# EAGLE design nanobeam_soil_sensor (EAGLE 9.6.2)

## Sheet 1 of 2
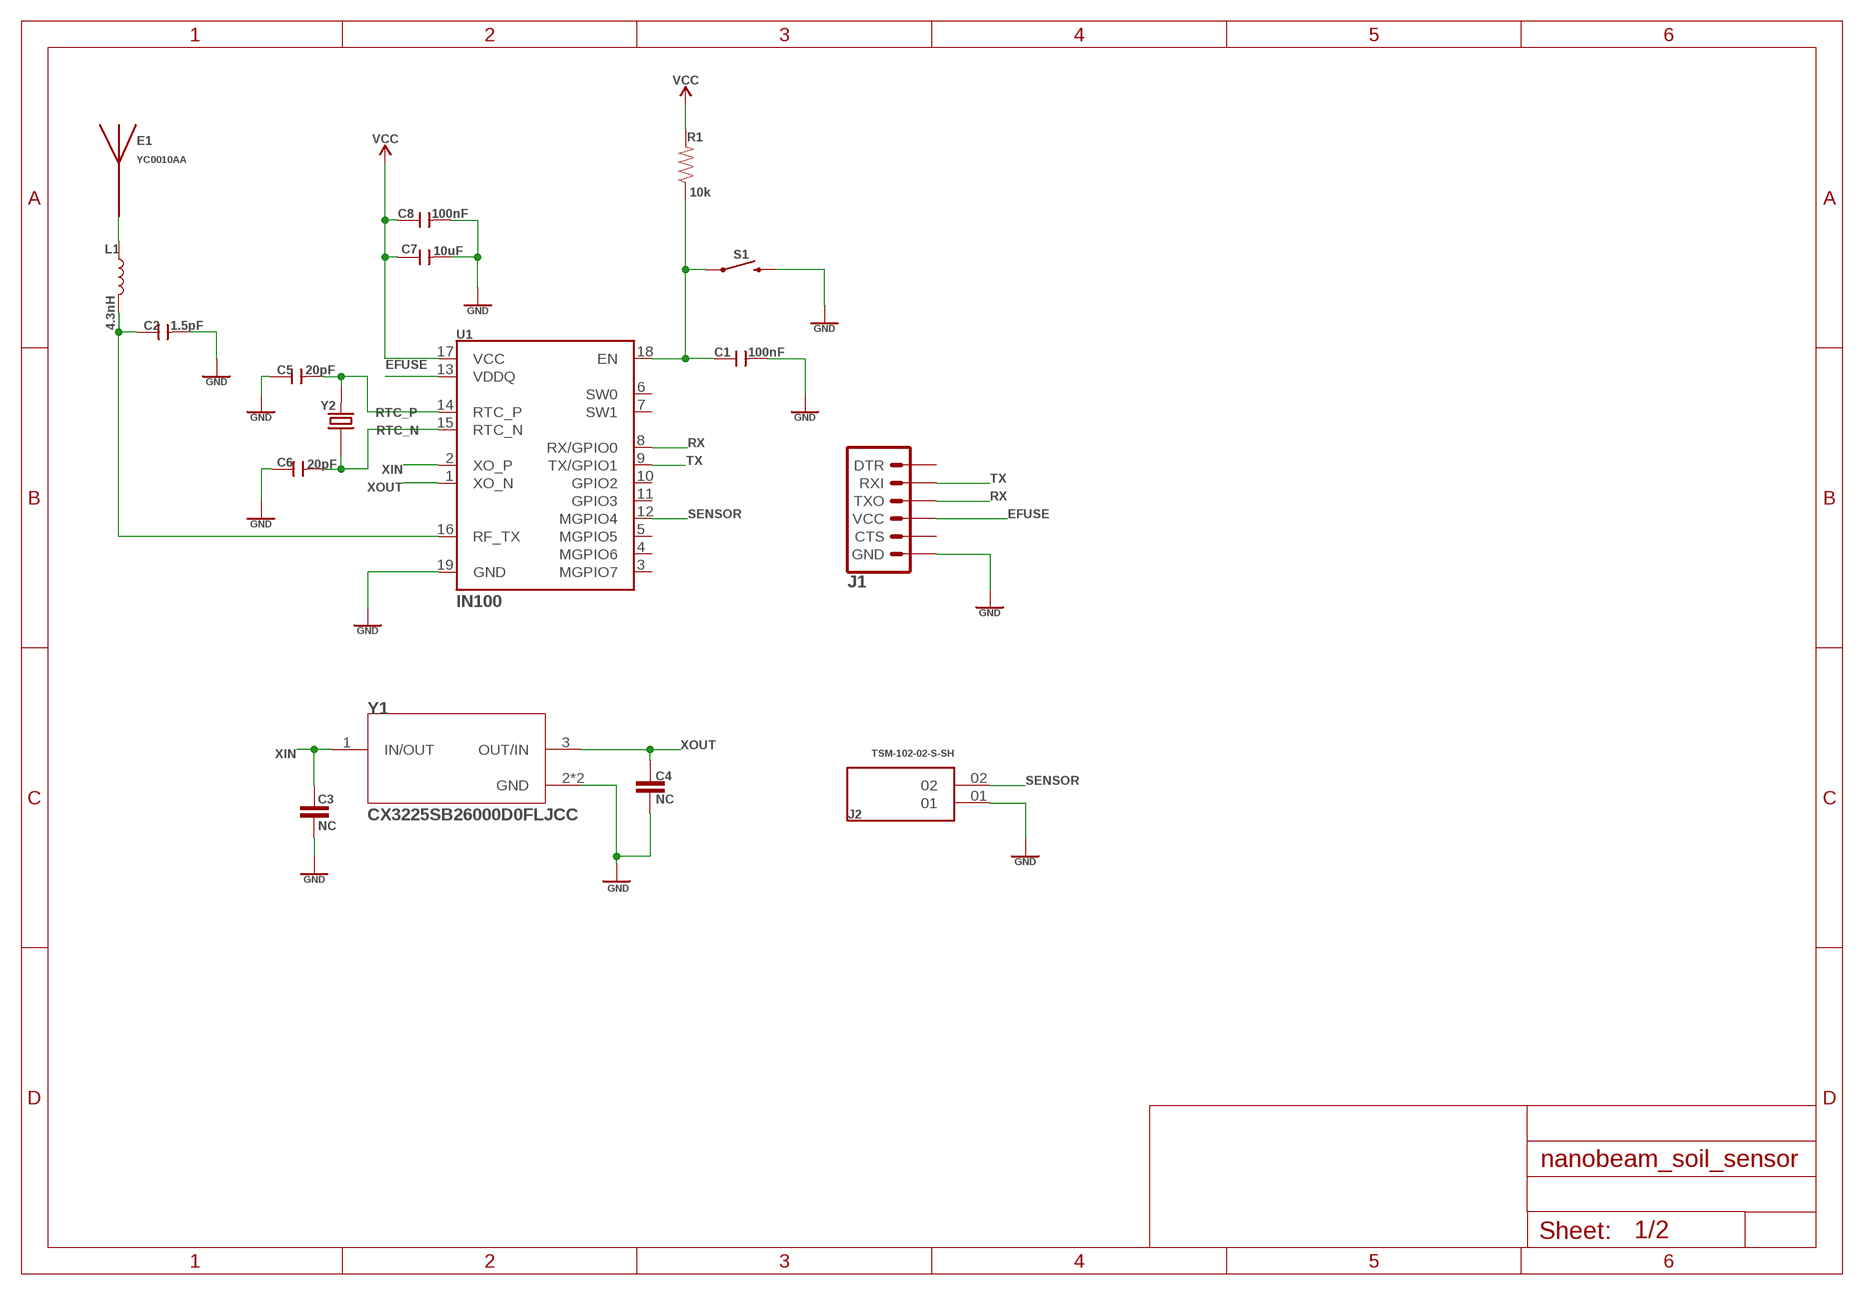
[diagram p0: schematic, sheet 1]

### Parts
C1  100nF  CERAMIC-100NF-50V-10%-X7R(0603)  [C0603]
C2  1.5pF  CERAMIC-10PF-50V-5%-NPO(0603)  [C0603]
C3  NC  12PF-0603-50V-5%  [0603]
C4  NC  12PF-0603-50V-5%  [0603]
C5  20pF  CERAMIC-22PF-50V-5%-NPO(0603)  [C0603]
C6  20pF  CERAMIC-22PF-50V-5%-NPO(0603)  [C0603]
C7  10uF  CERAMIC-10UF-10V-10%-X5R(0603)  [C0603]
C8  100nF  CERAMIC-100NF-50V-10%-X7R(0603)  [C0603]
E1  YC0010AA  [XCVR_YC0010AA]
J1  6_PIN_SERIAL_TARGETSMD  [1X06-SMD_RA_MALE]
J2  TSM-102-02-S-SH  [SAMTEC_TSM-102-02-S-SH]
L1  4.3nH  INDUCTOR-0603-33NH  [0603]
R1  10k  10KOHM-0603-1/10W-1%  [0603]
S1  MOMENTARY-SWITCH-SPST-SMD-4.6X2.8MM  [TACTILE_SWITCH_SMD_4.6X2.8MM]
U1  IN100  [IN100]
Y1  CX3225SB26000D0FLJCC  ECS-480-8-33B-CWY-TR3  [XTAL_ECS-480-8-33B-CWY-TR3]
Y2  ECS-.327-12.5-16-TR  [XTAL_ECS-.327-12.5-16-TR]

### Nets
EFUSE: J1.4(VCC) U1.13(VDDQ)
GND: C1.2 C2.2 C3.2 C4.2 C5.1 C6.1 C7.2 C8.2 J1.6(GND) J2.01 S1.3 S1.4 U1.19(GND) Y1.2(GND) Y1.4(GND) ; also sheet 2
N$1: C2.1 L1.2 U1.16(RF_TX)
N$2: E1.1 L1.1
N$3: C1.1 R1.1 S1.1 S1.2 U1.18(EN)
RTC_N: C6.2 U1.15(RTC_N) Y2.1
RTC_P: C5.2 U1.14(RTC_P) Y2.2
RX: J1.3(TXO) U1.8(RX/GPIO0)
SENSOR: J2.02 U1.12(MGPIO4)
TX: J1.2(RXI) U1.9(TX/GPIO1)
VCC: C7.1 C8.1 R1.2 U1.17(VCC) ; also sheet 2
XIN: C3.1 U1.2(XO_P) Y1.1(IN/OUT)
XOUT: C4.1 U1.1(XO_N) Y1.3(OUT/IN)
Unconnected: J1.1(DTR) J1.5(CTS) U1.3(MGPIO7) U1.4(MGPIO6) U1.5(MGPIO5) U1.6(SW0) U1.7(SW1) U1.10(GPIO2) U1.11(GPIO3)

## Sheet 2 of 2
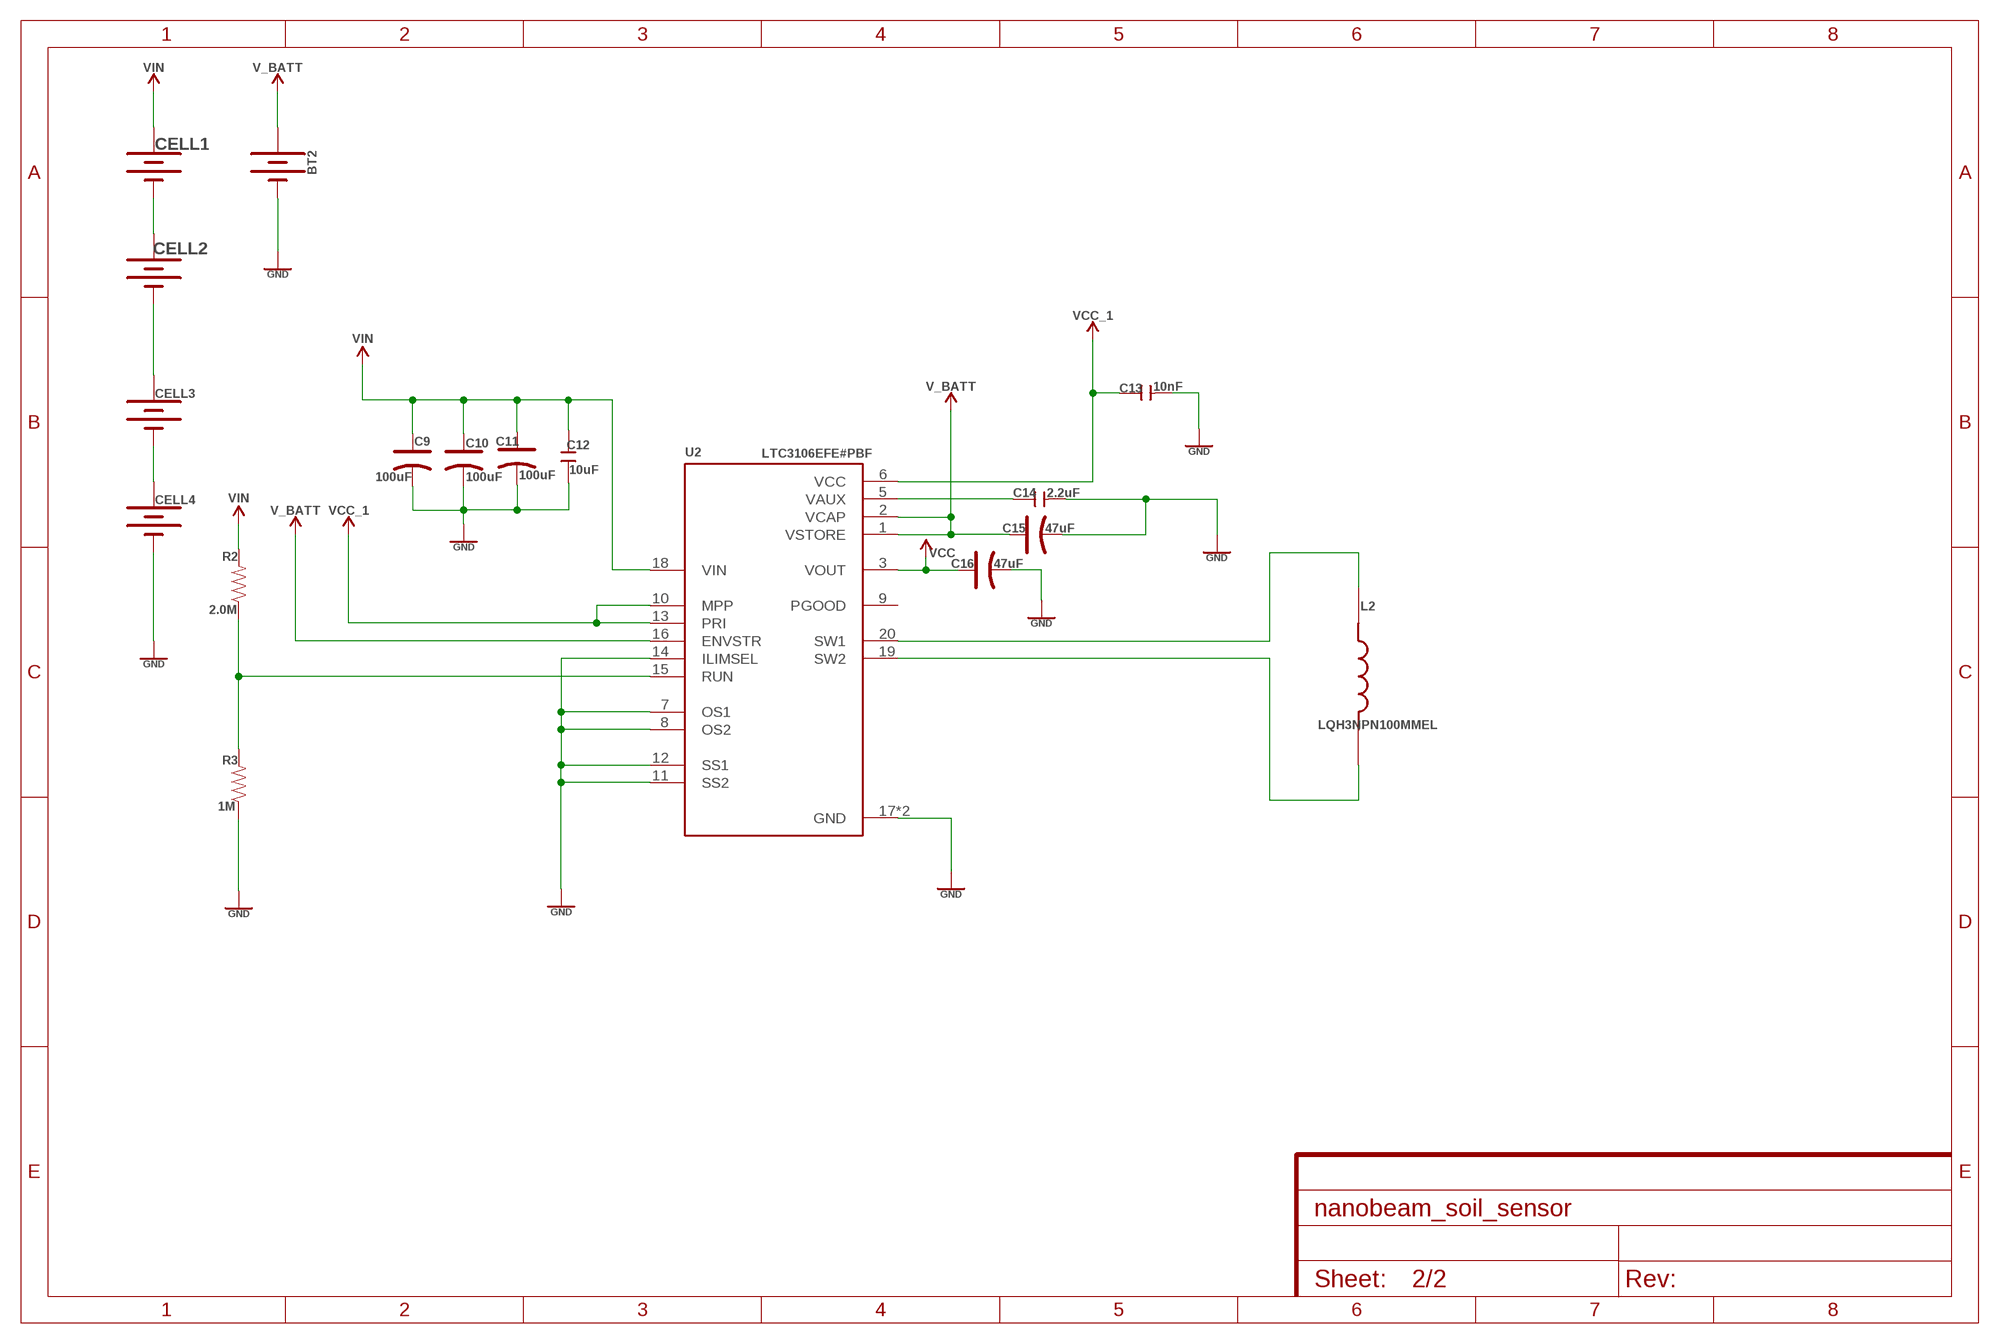
[diagram p1: schematic, sheet 2]

### Parts
BT2  BATTERY-12MM_SMD  [BATTCON_12MM]
C9  100uF  TANTALUM-SMD-47UF-6.3V(AVX-A)  [AVX-A]
C10  100uF  TANTALUM-SMD-47UF-6.3V(AVX-A)  [AVX-A]
C11  100uF  TANTALUM-SMD-47UF-6.3V(AVX-A)  [AVX-A]
C12  10uF  CERAMIC-10UF-6.3V-20%-X5R(0603)  [C0603]
C13  10nF  CERAMIC-10NF-50V-10%-X7R(0603)  [C0603]
C14  2.2uF  CERAMIC-2.2UF-10V-10%-X7R(0603)  [C0603]
C15  47uF  TANTALUM-SMD-47UF-6.3V(AVX-A)  [AVX-A]
C16  47uF  TANTALUM-SMD-47UF-6.3V(AVX-A)  [AVX-A]
CELL1  KXOB25  [KXOB25]
CELL2  KXOB25  [KXOB25]
CELL3  KXOB25  [KXOB25]
CELL4  KXOB25  [KXOB25]
L2  LQH3NPN100MMEL  [IND_LQH3NPN100MMEL]
R2  2.0M  2MOHMS-0603-1/10W-1%  [0603]
R3  1M  1MOHM-0603-1/4W-5%  [0603]
U2  LTC3106EFE#PBF  [SOP65P640X120-21N]

### Nets
GND: BT2.GND(-) C9.- C10.- C11.- C12.1 C13.2 C14.2 C15.- C16.- CELL4.- R3.1 U2.7(OS1) U2.8(OS2) U2.11(SS2) U2.12(SS1) U2.14(ILIMSEL) U2.17(GND) U2.21(GND) ; also sheet 1
N$4: L2.1 U2.20(SW1)
N$5: L2.2 U2.19(SW2)
N$6: CELL1.- CELL2.+
N$7: CELL2.- CELL3.+
N$8: CELL3.- CELL4.+
N$9: C14.1 U2.5(VAUX)
N$10: R2.1 R3.2 U2.15(RUN)
V_BATT: BT2.PWR@1(+) C15.+ U2.1(VSTORE) U2.2(VCAP) U2.16(ENVSTR)
VCC: C16.+ U2.3(VOUT) ; also sheet 1
VCC_1: C13.1 U2.6(VCC) U2.10(MPP) U2.13(PRI)
VIN: C9.+ C10.+ C11.+ C12.2 CELL1.+ R2.2 U2.18(VIN)
Unconnected: U2.9(PGOOD)

## Library data of the parts
BT2 = SparkFun-Batteries:BATTERY: Battery - Single Cell A variety of battery chemistries, sizes, and footprints. Device List: 20MM_PTH - Coin Cell Battery Holder - 20mm (PTH) <https://www.sparkfun.com/products/783> 6.8MM_PTH - Coin Cell Battery Holder - 6.8MM(SMD) <https://www.digikey.com/product-detail/en/seiko-instruments/MS621FE-FL11E/728-1057-ND/1889208?WT.srch=1&gclid=CNOQ5a6LzdQCFZS2wAodXCkE0g> 12MM_SMD - Coin Cell Battery Holder - 12mm (SMD) <https://www.sparkfun.com/products/10592> 12MM_PTH - Coin Cell Battery Holder - 12mm (PTH) <https://www.sparkfun.com/products/7948> 20MM_SMD - 20mm Coin Cell Battery Holder (SMD) (2 legs) Used on the Big Time Watch Kit <https://www.sparkfun.com/products/11734> 20MM_SMD_4LEGS - Coin Cell Battery Holder - 20mm (SMD) <https://www.sparkfun.com/products/11892> 20MM_SMD_4LEGS_OVERPASTE - Coin Cell Battery Holder - 20mm (SMD) <https://www.sparkfun.com/products/11892> (Over-paste on the legs) 24.5MM_PTH - Coin Cell Battery Holder - 24.5mm (PTH) <https://www.sparkfun.com/products/8863> 9V - 9V Battery Holder - PC Mount Used on the SparkFun SparkPunk Sound Kit <https://www.sparkfun.com/products/11177> and SparkFun SparkPunk Sequencer Kit <https://www.sparkfun.com/products/12707> 18650 - Battery Holder - 18650 (PTH) <https://www.sparkfun.com/products/13113> AA - Battery Holder - 1xAA (PTH) <https://www.sparkfun.com/products/7949> AAA - Battery Holder - 1xAAA (PTH) <https://www.sparkfun.com/products/12718> AA_KIT - Battery Holder - 1xAA (PTH) <https://www.sparkfun.com/products/7949> Special kit package - pads only have exposed copper on one side of the board. AAA_KIT - Battery Holder - 1xAAA (PTH) <https://www.sparkfun.com/products/12718> Special kit package - pads only have exposed copper on one side of the board.; PROD_ID: BATT-08044; SF_SKU: PRT-10592
C1 C8 = OPL_Capacitor:CERAMIC-100NF-50V-10%-X7R(0603): 302010138; MPN: CC0603KRX7R9BB104; VALUE: 100nf
C2 = OPL_Capacitor:CERAMIC-10PF-50V-5%-NPO(0603): 302010097; MPN: CC0603JRNPO9BN100; VALUE: 10pf
C3 C4 = SparkFun-Capacitors:12PF: 12pF ceramic capacitors A capacitor is a passive two-terminal electrical component used to store electrical energy temporarily in an electric field.; PROD_ID: CAP-09137; VALUE: 12pF
C5 C6 = OPL_Capacitor:CERAMIC-22PF-50V-5%-NPO(0603): 302010143; MPN: CC0603JRNPO9BN220; VALUE: 22pf
C7 = OPL_Capacitor:CERAMIC-10UF-10V-10%-X5R(0603): 302010103; MPN: CC0603KRX5R6BB106; VALUE: 10uf
C9-C11 C15 C16 = OPL_Capacitor:TANTALUM-SMD-47UF-6.3V(AVX-A): 302020005; MPN: TAJA476*006#NJ; VALUE: 47uf
C12 = OPL_Capacitor:CERAMIC-10UF-6.3V-20%-X5R(0603): 302010286; MPN: CC0603MRX5R5BB106; VALUE: 10UF 6.3V
C13 = OPL_Capacitor:CERAMIC-10NF-50V-10%-X7R(0603): 302010140; MPN: CC0603KRX7R9BB103; VALUE: 10nf
C14 = OPL_Capacitor:CERAMIC-2.2UF-10V-10%-X7R(0603): 302010054; MPN: CC0603KRX7R6BB225; VALUE: 2.2uf
CELL1-CELL4 = KXOB25:KXOB25
E1 = YC0010AA:YC0010AA: 2400 ~ 2500MHz, Wi-Fi（BT）, 5.2*2.0*1.2mm,ceramic SMD Antenna Check availability <https://pricing.snapeda.com/parts/YC0010AA/Quectel/view-part?ref=eda>; AVAILABILITY: In Stock; DESCRIPTION: 2400 ~ 2500MHz, Wi-Fi（BT）, 5.2*2.0*1.2mm,ceramic SMD Antenna; MF: Quectel; MP: YC0010AA; PACKAGE: None; PRICE: None; PURCHASE-URL: https://pricing.snapeda.com/search/part/YC0010AA/?ref=eda
J1 = SparkFun-Connectors:6_PIN_SERIAL_TARGET: 6-pin header connection for use with the "FTDI BASIC" pinout - TARGET SIDE. Also known as "Arduino Serial Program Header". It is used to mate with our FTDI Basic serial programmers using the Arduino IDE. Note, this device has "TARGET" in the name. It is intended to be used on a design that contains a target micro-controller that you wish to program. The "sister" device, named "CABLE" is inteneded to be used on a design that usually lives on the end of your USB cable and prvides the converter chip (FTDI232 or FTDI231x) to commnicate serial RX/TX. You can populate with some of these: Break Away Headers - Straight <https://www.sparkfun.com/products/116> (PRT-00116) For reference (or to suit your programming needs) check out these designs: SparkFun FTDI Basic Breakout - 5V <https://www.sparkfun.com/products/9716> (DEV-09716) SparkFun FTDI Basic Breakout - 3.3V <https://www.sparkfun.com/products/9873> (DEV-09873) SparkFun FTDI SmartBasic <https://www.sparkfun.com/products/12935> (DEV-12935) SparkFun Beefy 3 - FTDI Basic Breakout <https://www.sparkfun.com/products/13746> (DEV-13746); PROD_ID: CONN-08971
J2 = TSM-102-02-S-SH:TSM-102-02-S-SH: Check availability <https://pricing.snapeda.com/parts/TSM-102-02-S-SH/Samtec/view-part?ref=eda>; AVAILABILITY: In Stock; DESCRIPTION: TSM - Samtec 2.54mm Single Row Horizontal Surface Mount Header 8.13mm Post Height (02) - Fast Stock; MF: Samtec; MP: TSM-102-02-S-SH; PACKAGE: None; PRICE: None; PURCHASE-URL: https://pricing.snapeda.com/search/part/TSM-102-02-S-SH/?ref=eda
L1 = SparkFun-Coils:INDUCTOR: Inductors Resist changes in electrical current. Basically a coil of wire. SparkFun Products: SparkFun Load Cell Amplifier - HX711 <https://www.sparkfun.com/products/13879> IOIO-OTG - V2.2 <https://www.sparkfun.com/products/13613>; PROD_ID: NDUC-07874; VALUE: 33nH/±5%/500mA
L2 = LQH3NPN100MMEL:LQH3NPN100MMEL: Fixed Inductors; DESCRIPTION: 10µH Shielded Wirewound Inductor 800mA 228mOhm Max 1212 (3030 Metric); DIGI-KEY_PART_NUMBER: 490-15945-1-ND; DIGIKEY-PURCHASE-URL: https://snapeda.com/shop?store=DigiKey&id=4547508; MF: Murata; MOUSER-PURCHASE-URL: https://snapeda.com/shop?store=Mouser&id=4547508; MP: LQH3NPN100MMEL; PACKAGE: 1212 Murata
R1 = SparkFun-Resistors:10KOHM: 10kΩ resistor A resistor is a passive two-terminal electrical component that implements electrical resistance as a circuit element. Resistors act to reduce current flow, and, at the same time, act to lower voltage levels within circuits. - Wikipedia; PROD_ID: RES-00824
R2 = SparkFun-Resistors:2MOHMS: 2MΩ resistor A resistor is a passive two-terminal electrical component that implements electrical resistance as a circuit element. Resistors act to reduce current flow, and, at the same time, act to lower voltage levels within circuits. - Wikipedia; PROD_ID: RES-10054
R3 = SparkFun-Resistors:1MOHM: 1MΩ resistor A resistor is a passive two-terminal electrical component that implements electrical resistance as a circuit element. Resistors act to reduce current flow, and, at the same time, act to lower voltage levels within circuits. - Wikipedia; PROD_ID: RES-07868
S1 = SparkFun-Switches:MOMENTARY-SWITCH-SPST: Momentary Switch (Pushbutton) - SPST Normally-open (NO) SPST momentary switches (buttons, pushbuttons). Variants PTH-12MM - 12mm square, through-hole Momentary Pushbutton Switch - 12mm Square <https://www.sparkfun.com/products/9190> (COM-09190) PTH-6.0MM, PTH-6.0MM-KIT - 6.0mm square, through-hole Mini Pushbutton Switch <https://www.sparkfun.com/products/97> (COM-00097) KIT package intended for soldering kit's - only one side of pads' copper is exposed. PTH-RIGHT-ANGLE-KIT - Right-angle, through-hole Right Angle Tactile Button <https://www.sparkfun.com/products/10791> - Used on SparkFun BigTime Watch Kit <https://www.sparkfun.com/products/11734> SMD-12MM - 12mm square, surface-mount Tactile Button - SMD (12mm) <https://www.sparkfun.com/products/12993> (COM-12993) Used on SparkFun PicoBoard <https://www.sparkfun.com/products/11888> SMD-4.5MM - 4.5mm Square Trackball Switch Used on SparkFun Blackberry Trackballer Breakout <https://www.sparkfun.com/products/13169> SMD-4.6MMX2.8MM - 4.60mm x 2.80mm, surface mount Used on SparkFun SAMD21 Mini Breakout <https://www.sparkfun.com/products/13664> SMD-5.2MM, SMD-5.2-REDUNDANT - 5.2mm square, surface-mount Mini Pushbutton Switch - SMD <https://www.sparkfun.com/products/8720> (COM-08720) Used on Arduino Pro Mini <https://www.sparkfun.com/products/11114> REDUNDANT package connects both switch circuits together SMD-6.0X3.5MM - 6.0 x 3.5mm, surface mount Momentary Reset Switch SMD <https://www.sparkfun.com/products/8229> (COM-08229) SMD-6.2MM-TALL - 6.2mm square, surface mount Tactile Button - SMD (6mm) <https://www.sparkfun.com/products/12992> Used on SparkFun Digital Sandbox <https://www.sparkfun.com/products/12651> SMD-RIGHT-ANGLE - Right-angle, surface mount Used on SparkFun Block for Intel® Edison - Arduino <https://www.sparkfun.com/products/13036>; PROD_ID: SWCH-13065
U1 = IN100:IN100; PROD_ID: IC-17260
U2 = LTC3106EFE_PBF:LTC3106EFE#PBF: LTC3106 - 300mA Low Voltage Buck-Boost Converter with PowerPath and 1.6μA Quiescent Current; DESCRIPTION: Conv DC-DC -0.3V to 6V Non-Inv/Inv/Step Up/Step Down Single-Out 1.8V/2.2V/3.3V/5V 0.3A 20-Pin TSSOP; MF: Analog Devices; MOUSER-PURCHASE-URL: https://snapeda.com/shop?store=Mouser&id=4332360; MP: LTC3106EFE#PBF; PACKAGE: TSSOP W/ EP-20 Analog Devices
Y1 = CX3225SB26000D0FLJCC:ECS-480-8-33B-CWY-TR3: Check availability <https://pricing.snapeda.com/parts/ECS-480-8-33B-CWY-TR3/ECS%20Inc./view-part?ref=eda>; AVAILABILITY: In Stock; DESCRIPTION: Crystal - 48MHz ±10ppm - 10 pF - ±15 ppm - -30 to +85°C 3225 Low aging; MF: Kyocera; MP: CX3225SB26000D0FLJCC; PACKAGE: None; PRICE: None; PURCHASE-URL: https://pricing.snapeda.com/search/part/ECS-480-8-33B-CWY-TR3/?ref=eda
Y2 = ECS-.327-12.5-16-TR:ECS-.327-12.5-16-TR: SMD Tuning Fork Crystal Check availability <https://pricing.snapeda.com/parts/ECS-.327-12.5-16-TR/ECS%20Inc./view-part?ref=eda>; AVAILABILITY: In Stock; DESCRIPTION: 32.768 kHz ±20ppm Crystal 12.5pF 90 kOhms 2-SMD, No Lead; MF: ECS Inc.; MP: ECS-.327-12.5-16-TR; PACKAGE: SMD-2 ECS International; PRICE: None; PURCHASE-URL: https://pricing.snapeda.com/search/part/ECS-.327-12.5-16-TR/?ref=eda

## Board
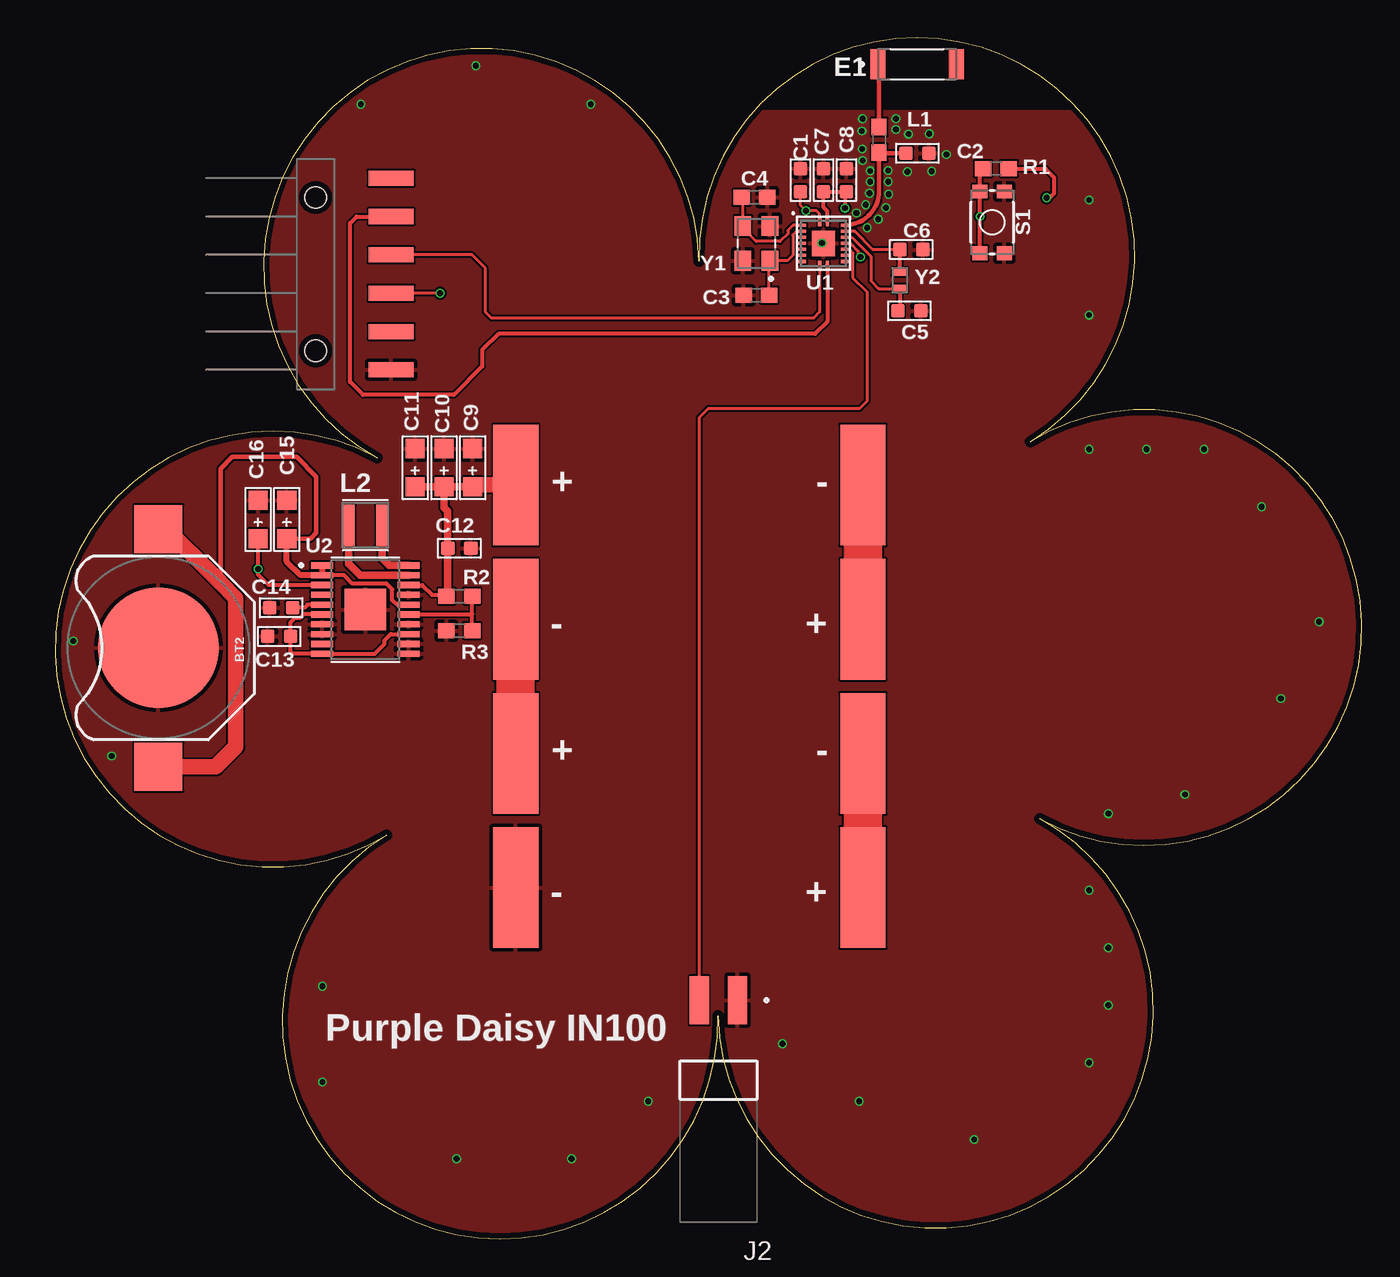
[diagram p2: board, top side]
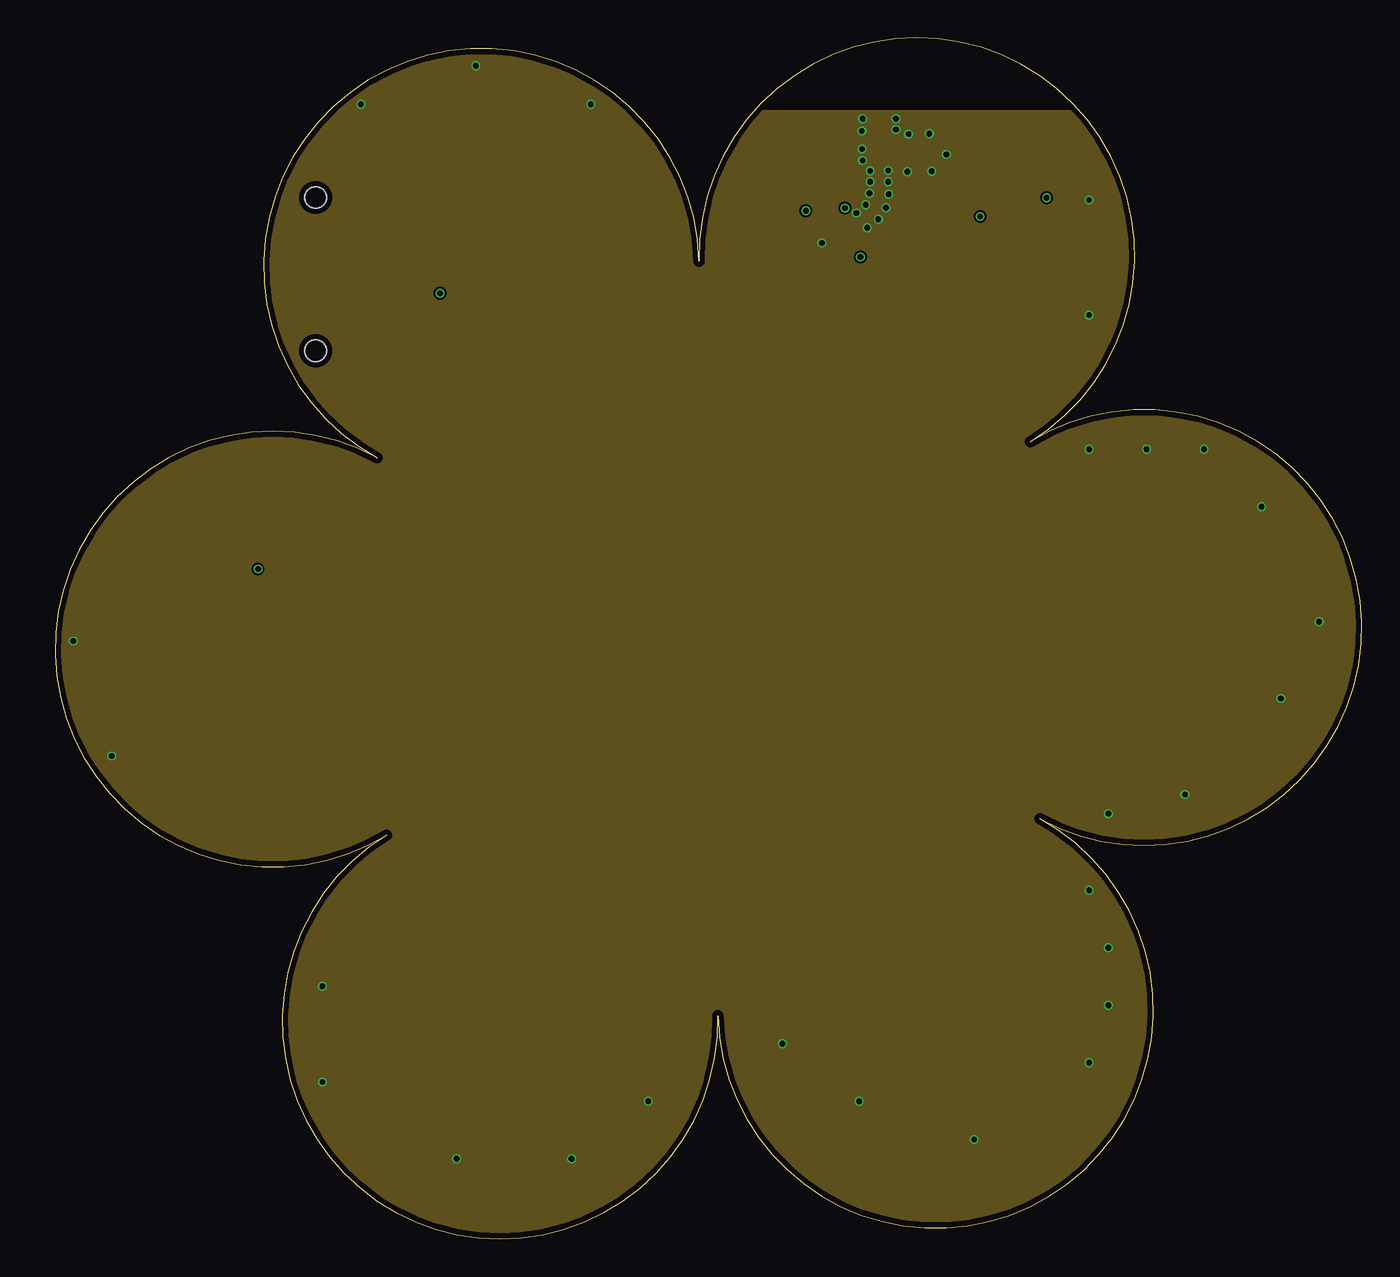
[diagram p3: board, inner layer Route2]
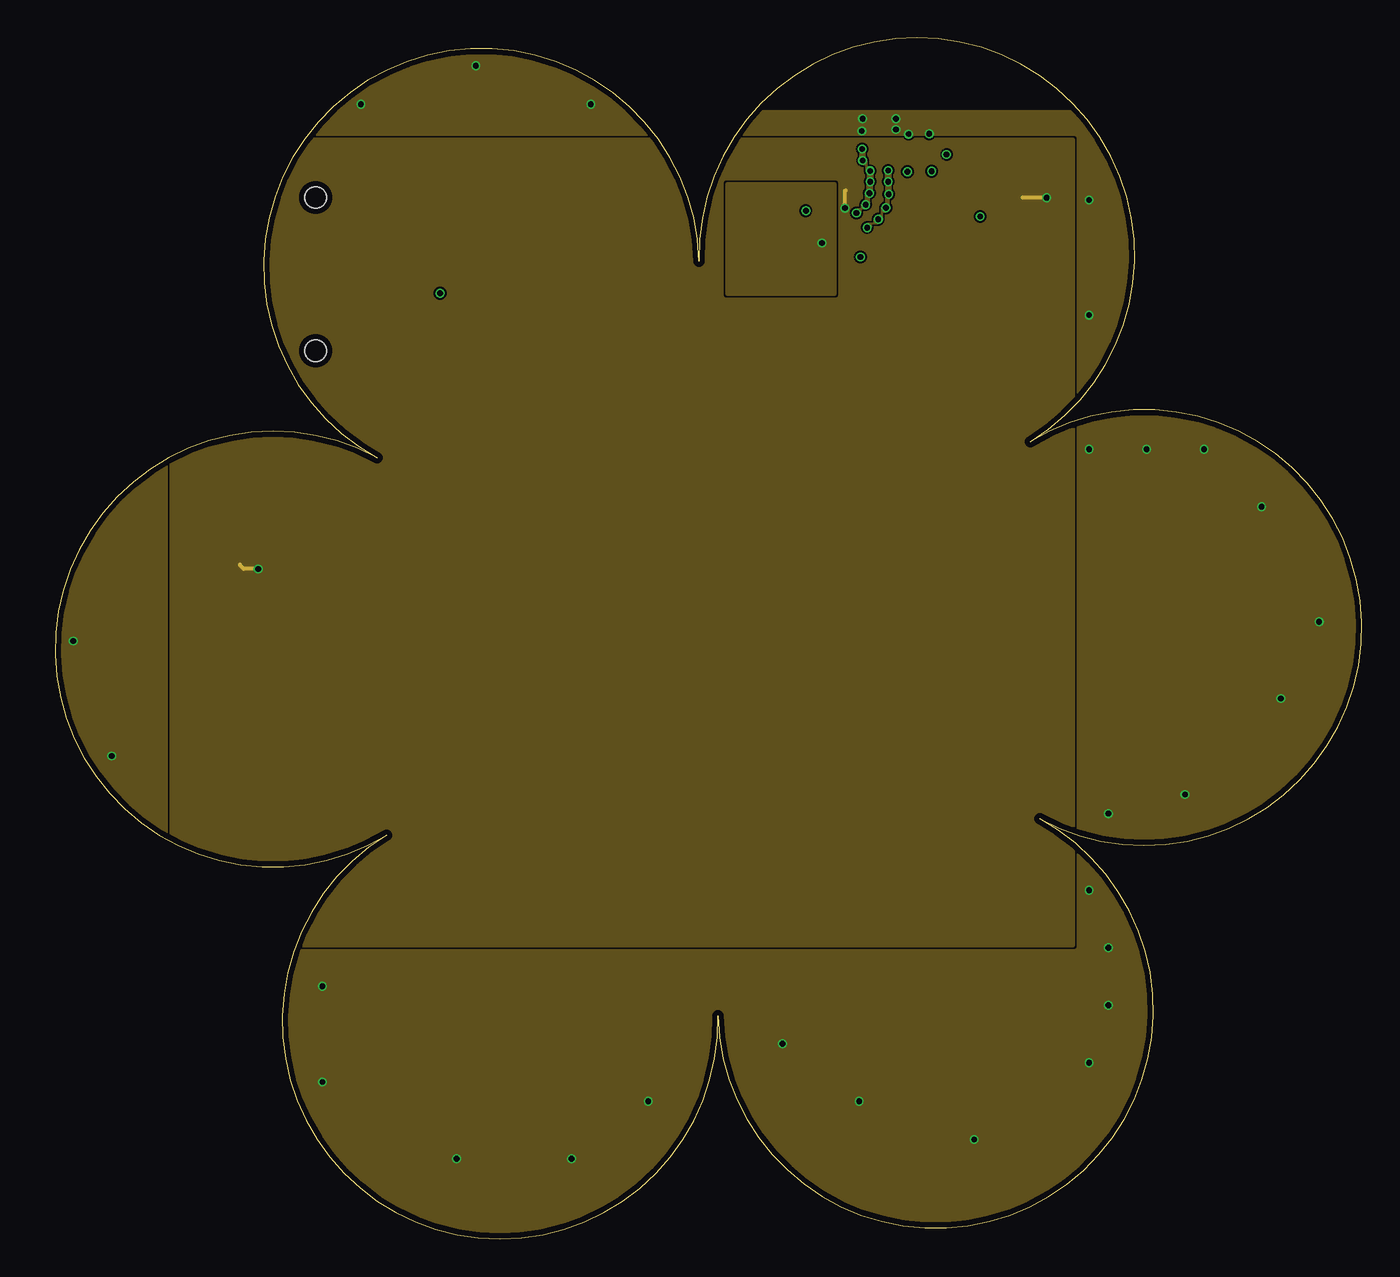
[diagram p4: board, inner layer Route15]
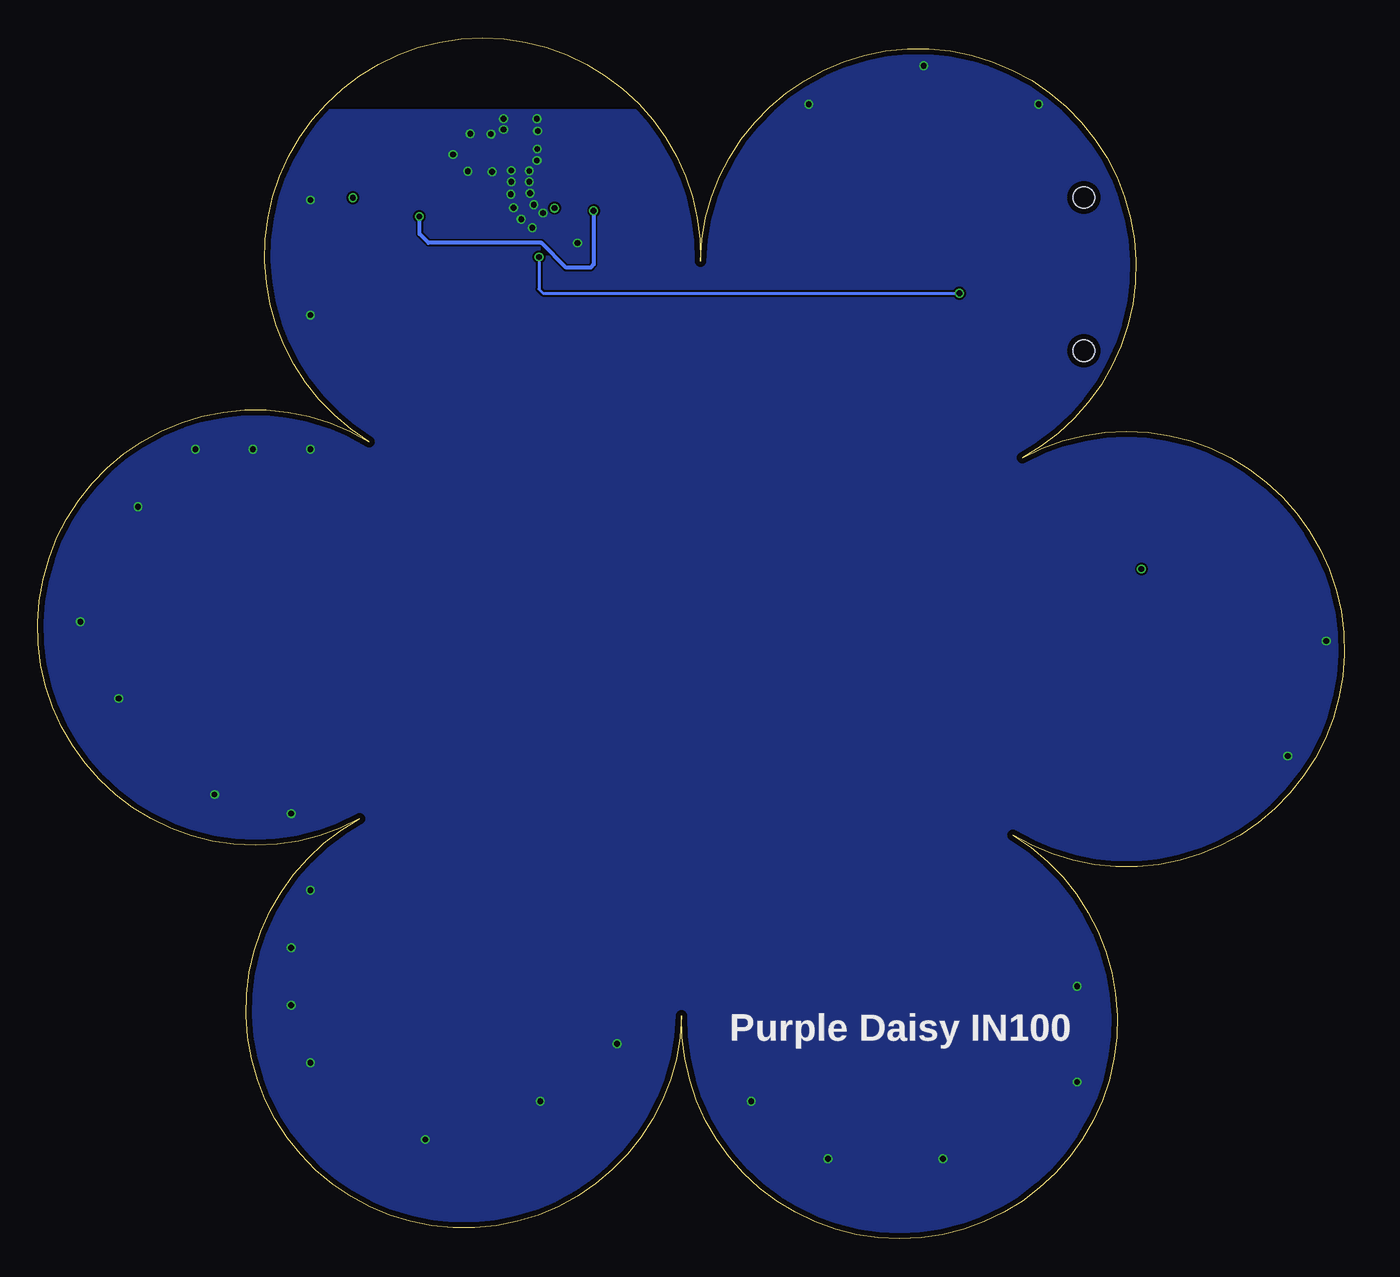
[diagram p5: board, bottom side, seen from below]

Size 86.58 x 79.57 mm. Coordinates in mm from the lower left corner, seen from the top.
Outline: 42.67,64.78 arc240 21.34,51.74 arc240 21.95,26.75 arc240 43.91,14.79 arc240 65.24,27.82 arc240 64.62,52.82 arc240 42.67,64.78
Copper layers (1*2*15*16): Top 0.035559375mm / dielectric 0.17018125mm / Route2 0.01778125mm / dielectric 47mil / Route15 0.01778125mm / dielectric 0.17018125mm / Bottom 0.035559375mm
Design rules "oshpark-4layer": minimum track width 5mil, minimum drill 10mil, track to track 5mil, track to pad 5mil, pad to pad 5mil, via to via 5mil, smd to smd 5mil, copper to edge 15mil, drill to drill 6mil, minimum pad ring 4mil, minimum via ring 4mil, stop-mask expansion 1.5mil, vias tented up to drill 0mil, thermal gap 10mil

### Footprints (pad centres in the part's own frame; a part is rotated, then mirrored left to right if it is on the bottom)
BATTCON_12MM = smd 8 x 8: GND 0,0 | smd 3.175 x 3.175: PWR@1 -7.874,0; PWR@2 7.874,0
C0603 = smd 0.889 x 0.889: 1 0,0.762; 2 0,-0.762
0603 = smd 1.1 x 1: 1 -0.85,0; 2 0.85,0
AVX-A = smd 1.27 x 1.27: + -1.27,0; - 1.27,0
KXOB25 = smd 3 x 8: + -11.5,0; - 11.5,0
XCVR_YC0010AA = smd 1 x 2: 1 -2.6,0; 2 2.6,0
1X06-SMD_RA_MALE = smd 1 x 3: 1 -6.35,5; 2 -3.81,5; 3 -1.27,5; 4 1.27,5; 5 3.81,5; 6 6.35,5 | hole 1.4: -5.08,0; 5.08,0
SAMTEC_TSM-102-02-S-SH = smd 1.27 x 3.18: 01 -1.27,-5.28; 02 1.27,-5.28
IND_LQH3NPN100MMEL = smd 0.8 x 2.7: 1 -1.1,0; 2 1.1,0
TACTILE_SWITCH_SMD_4.6X2.8MM = smd 0.9 x 1: 1 -2.05,-0.8; 2 2.05,-0.8; 3 2.05,0.8; 4 -2.05,0.8
IN100 = smd 0.5 x 0.2: 1 -1.4,1.2; 2 -1.4,0.8; 3 -1.4,0.4; 4 -1.4,0; 5 -1.4,-0.4; 6 -1.4,-0.8; 7 -1.4,-1.2; 10 1.4,-1.2; 11 1.4,-0.8; 12 1.4,-0.4; 13 1.4,0; 14 1.4,0.4; 15 1.4,0.8; 16 1.4,1.2 | smd 0.2 x 0.5: 8 -0.25,-1.4; 9 0.25,-1.4; 17 0.25,1.4; 18 -0.25,1.4 | smd 1.5 x 1.7: 19 0,0
SOP65P640X120-21N = smd 1.48 x 0.41: 1 -2.865,2.925; 2 -2.865,2.275; 3 -2.865,1.625; 4 -2.865,0.975; 5 -2.865,0.325; 6 -2.865,-0.325; 7 -2.865,-0.975; 8 -2.865,-1.625; 9 -2.865,-2.275; 10 -2.865,-2.925; 11 2.865,-2.925; 12 2.865,-2.275; 13 2.865,-1.625; 14 2.865,-0.975; 15 2.865,-0.325; 16 2.865,0.325; 17 2.865,0.975; 18 2.865,1.625; 19 2.865,2.275; 20 2.865,2.925 | smd 2.74 x 2.74: 21 0,0
XTAL_ECS-480-8-33B-CWY-TR3 = smd 1.3 x 1.1: 1 -1.15,-0.9; 2 1.15,-0.9; 3 1.15,0.9; 4 -1.15,0.9
XTAL_ECS-.327-12.5-16-TR = smd 0.5 x 1: 1 -0.55,0; 2 0.55,0

### Placement (x,y rotation side)
BT2  6.84,39.15 90 top
C1  49.38,70.14 180 top
C2  57.13,71.91 90 top
C3  46.46,62.52 180 top
C4  46.34,68.99 0 top
C5  56.6,61.47 270 top
C6  56.72,65.54 270 top
C7  50.91,70.14 180 top
C8  52.43,70.14 180 top
C9  27.67,51.09 90 top
C10  25.76,51.09 90 top
C11  23.86,51.09 90 top
C12  26.78,45.75 270 top
C13  14.84,39.91 270 top
C14  14.97,41.82 270 top
C15  15.35,47.66 90 top
C16  13.44,47.66 90 top
CELL1  42.02,49.94 0 top
CELL2  42.02,41.05 180 top
CELL3  42.02,32.16 0 top
CELL4  42.02,23.27 180 top
E1  57.11,77.81 0 top
J1  17.25,63.91 270 top
J2  43.95,10.52 180 top
L1  54.59,72.8 270 top
L2  20.56,47.28 180 top
R1  62.34,70.9 0 top
R2  26.78,42.58 180 top
R3  26.78,40.29 0 top
S1  62.08,67.34 270 top
U1  50.91,65.95 0 top
U2  20.56,41.69 0 top
Y1  46.46,65.95 90 top
Y2  55.96,63.51 270 top

### Tracks (layer width: path | path; a pad name or v marks a point on that pad's centre or on a via)
EFUSE  (via drill 0.38)
  Top 0.203: v25.51,62.64 J1.4 | v53.36,65.04 53.21,65.2 53.21,65.43 52.7,65.95 U1.13
  Bottom 0.203: v53.36,65.04 53.36,62.91 53.09,62.64 v25.51,62.64
GND  (via drill 0.38)
  other vias: 50.81,65.97 53.09,67.95 53.7,68.51 53.96,69.27 54.01,70.03 54.01,70.75 55.2,70.77 55.2,70.03 55.23,69.2 55.05,68.31 54.54,67.55 53.8,66.99 53.5,74.2 53.45,73.39 53.47,72.19 53.5,71.43 55.71,74.2 55.71,73.49 58.07,70.72 56.47,70.69 56.55,73.18 57.92,73.21 59.06,71.84 68.51,61.2 68.51,68.82 68.51,52.31 72.32,52.31 76.13,52.31 79.94,48.5 83.75,40.88 81.21,35.8 74.86,29.45 69.78,28.18 68.51,23.1 69.78,19.29 69.78,15.48 68.51,11.67 60.89,6.59 53.27,9.13 48.19,12.94 39.3,9.13 34.22,5.32 26.6,5.32 17.71,10.4 17.71,16.75 3.74,31.99 1.2,39.61 20.25,75.17 27.87,77.71 35.49,75.17
  pour Top: -10.05,7.02 -10.05,65.18 -0.53,74.71 14.71,74.71 21.7,81.69 33.26,81.69 40.24,74.71 91.55,74.71 94.6,71.66 94.6,6.89 83.55,-4.16 1,-4.16 -7.38,4.22 -7.51,4.22 -7.77,4.48 -7.77,4.73
  pour Route2: -1.16,60.1 20.43,81.69 33.13,81.69 40.11,74.71 92.56,74.71 94.22,73.06 94.22,5.87 74.66,-13.68 17,-13.68 -1.16,4.48
  pour Route15 (rank 3): -7.51,19.46 -7.51,58.83 16.62,82.96 31.86,82.96 34.4,80.42 40.11,74.71 40.49,74.71 92.31,74.71 94.85,72.17 94.85,6.51 74.53,-13.81 22.97,-13.81 -8.02,17.18 -8.02,18.96
  pour Route15: 44.56,62.64 44.56,69.86 45.98,69.86 51.62,69.86 51.62,66.58 51.62,62.59 44.58,62.59 44.56,62.59
  pour Bottom: -16.4,0.41 -16.4,51.21 17.89,85.5 29.32,85.5 38.21,76.61 40.11,74.71 67.21,74.71 100.84,74.71 101.96,73.59 101.96,-17.09 91.6,-27.45 8.92,-27.45 -16.4,-2.13
N$1
  Top 0.305: U1.16 arc90 54.59,69.43 L1.2 arc90 54.63,71.91 C2.1
N$2
  Top 0.305: L1.1 54.59,77.72 arc90 E1.1
N$3  (via drill 0.38)
  Top 0.203: U1.18 50.66,67.9 50.45,68.1 v49.74,68.1 49.38,68.46 C1.1
  Top 0.254: S1.2 v61.28,67.72 S1.1 61.28,70.69 R1.1
  Bottom 0.254: v49.74,68.1 49.74,64.55 49.94,64.35 51.57,64.35 53.19,65.97 60.69,65.97 61.28,66.57 v61.28,67.72
N$4
  Top 0.508: U2.20 22.13,44.61 21.65,45.09 L2.1
N$5
  Top 0.508: U2.19 20.21,43.96 19.46,44.72 L2.2
N$6
  Top 2.54: CELL1.- CELL2.+
N$7
  Top 0.254: 30.59,43.59 30.52,43.52 CELL2.-
  Top 2.54: CELL3.+ CELL2.- 30.52,42.32 30.59,42.32 30.59,43.59
N$8
  Top 2.54: CELL4.+ CELL3.-
N$9
  Top 0.254: U2.5 16.71,42.01 16.52,41.82 C14.1
N$10
  Top 0.254: R3.2 27.63,41.38 | 27.63,41.38 R2.1 | U2.15 27.61,41.36 27.63,41.38
RTC_N
  Top 0.203: C6.2 54.19,65.54 52.98,66.75 U1.15
  Top 0.254: Y2.1 C6.2
RTC_P
  Top 0.203: U1.14 52.79,66.35 54.06,65.08 54.06,63.46 54.57,62.95 Y2.2
  Top 0.254: Y2.2 55.96,61.6 C5.2
RX
  Top 0.203: U1.8 50.66,61.4 50.25,60.99 28.91,60.99 28.51,61.4 28.51,64.29 27.62,65.18 J1.3
SENSOR
  Top 0.203: J2.02 42.68,54.41 43.29,55.02 53.32,55.02 53.78,55.48 53.78,62.75 52.84,63.68 52.84,65.26 52.88,65.3 52.63,65.55 U1.12
TX
  Top 0.254: U1.9 51.16,60.76 50.35,59.95 29.37,59.95 28.3,58.88 28.3,57.79 26.42,55.91 20.4,55.91 19.54,56.78 19.54,67.29 19.97,67.72 J1.2
V_BATT
  Top 0.254: U2.16 22.64,42.01 22.33,42.32 22.33,43.03 21.95,43.42 19.69,43.42 19.13,43.97 17.7,43.97 U2.2
  Top 0.305: C15.+ 16.92,46.39 17.3,46.77 17.3,50.48 15.98,51.8 11.74,51.8 10.97,51.02 10.97,43.45
  Top 0.406: U2.1 U2.2 16.25,43.96 15.35,44.86 C15.+
  Top 1.016: BT2.PWR@1 10.65,31.27 11.97,32.6 11.97,42.45 10.97,43.45 6.86,47.56
VCC  (via drill 0.38)
  Top 0.254: U1.17 51.16,68.08 50.91,68.33 C7.1 C8.1 52.33,69.27 v52.33,68.28 | U2.3 14.13,43.31 13.44,44 v13.44,44.38 C16.+ | R1.2 65.62,70.9 66.17,70.34 66.17,69.22 65.92,68.97 v65.69,68.97
  Route15 0.254: v52.33,68.28 52.33,69.4 52.38,69.45 | v13.44,44.38 12.5,44.38 12.22,44.66 | v65.69,68.97 64.12,68.97 64.09,68.99
  pour Route15 (rank 2): 7.73,19.46 7.73,72.8 67.42,72.8 67.42,19.46
VCC_1
  Top 0.254: U2.6 16.46,41.36 16.21,41.12 15.87,41.12 15.58,40.82 15.58,39.94 C13.1 15.6,38.87 15.71,38.76 U2.10 21.16,38.76 21.83,39.43 21.83,39.66 22.23,40.06 U2.13
VIN
  Top 0.254: U2.18 24.32,43.31 24.96,42.67 26.02,42.67
  Top 0.508: R2.2 26.02,42.67 C12.2 26.02,48.19 25.76,48.44 C10.+ | C11.+ C10.+ | C10.+ C9.+
  Top 1.016: C9.+ 27.79,49.94 CELL1.+
XIN
  Top 0.203: U1.2 49.12,66.75 48.88,66.5 48.88,65.16 48.51,64.8 47.43,64.8 | 47.43,64.8 Y1.1 | C3.1 47.31,64.68 47.43,64.8
XOUT
  Top 0.203: C4.1 45.56,68.92 45.56,67.19 Y1.3 45.56,66.95 46.44,66.07 48.04,66.07 48.55,66.58 48.55,66.81 48.88,67.15 U1.1

### Text on the board
tNames: Purple Daisy IN100
bNames: Purple Daisy IN100